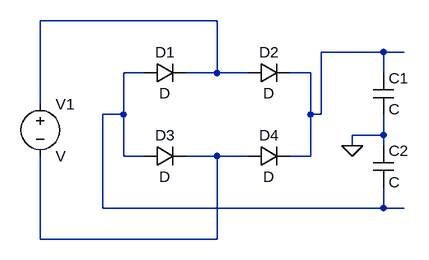
[diagram p0: schematic Draft2.asc]
Draft2.asc, the LTspice schematic file:
Version 4
SHEET 1 880 680
WIRE 320 48 48 48
WIRE 576 96 480 96
WIRE 608 96 576 96
WIRE 208 128 176 128
WIRE 320 128 320 48
WIRE 320 128 272 128
WIRE 368 128 320 128
WIRE 464 128 432 128
WIRE 576 128 576 96
WIRE 48 176 48 48
WIRE 176 192 176 128
WIRE 176 192 144 192
WIRE 464 192 464 128
WIRE 480 192 480 96
WIRE 480 192 464 192
WIRE 576 224 576 192
WIRE 576 224 528 224
WIRE 528 240 528 224
WIRE 576 240 576 224
WIRE 176 256 176 192
WIRE 208 256 176 256
WIRE 320 256 272 256
WIRE 368 256 320 256
WIRE 464 256 464 192
WIRE 464 256 432 256
WIRE 144 336 144 192
WIRE 576 336 576 304
WIRE 576 336 144 336
WIRE 608 336 576 336
WIRE 48 384 48 256
WIRE 320 384 320 256
WIRE 320 384 48 384
FLAG 528 240 0
SYMBOL voltage 48 160 R0
SYMATTR InstName V1
SYMBOL diode 208 144 R270
WINDOW 0 32 32 VTop 2
WINDOW 3 0 32 VBottom 2
SYMATTR InstName D1
SYMBOL diode 368 144 R270
WINDOW 0 32 32 VTop 2
WINDOW 3 0 32 VBottom 2
SYMATTR InstName D2
SYMBOL diode 208 272 R270
WINDOW 0 32 32 VTop 2
WINDOW 3 0 32 VBottom 2
SYMATTR InstName D3
SYMBOL diode 368 272 R270
WINDOW 0 32 32 VTop 2
WINDOW 3 0 32 VBottom 2
SYMATTR InstName D4
SYMBOL cap 560 128 R0
SYMATTR InstName C1
SYMBOL cap 560 240 R0
SYMATTR InstName C2

The netlist it stands for:
* Draft2.asc
V1 N001 N004 V
D1 N003 N001 D
D2 N001 N002 D
D3 N003 N004 D
D4 N004 N002 D
C1 N002 0 C
C2 0 N003 C
.model D D
.lib standard.dio
.backanno
.end